# Altium schematic sheet PowerRegulator.SchDoc
size A; SheetNumber: 1; SheetTotal: 1
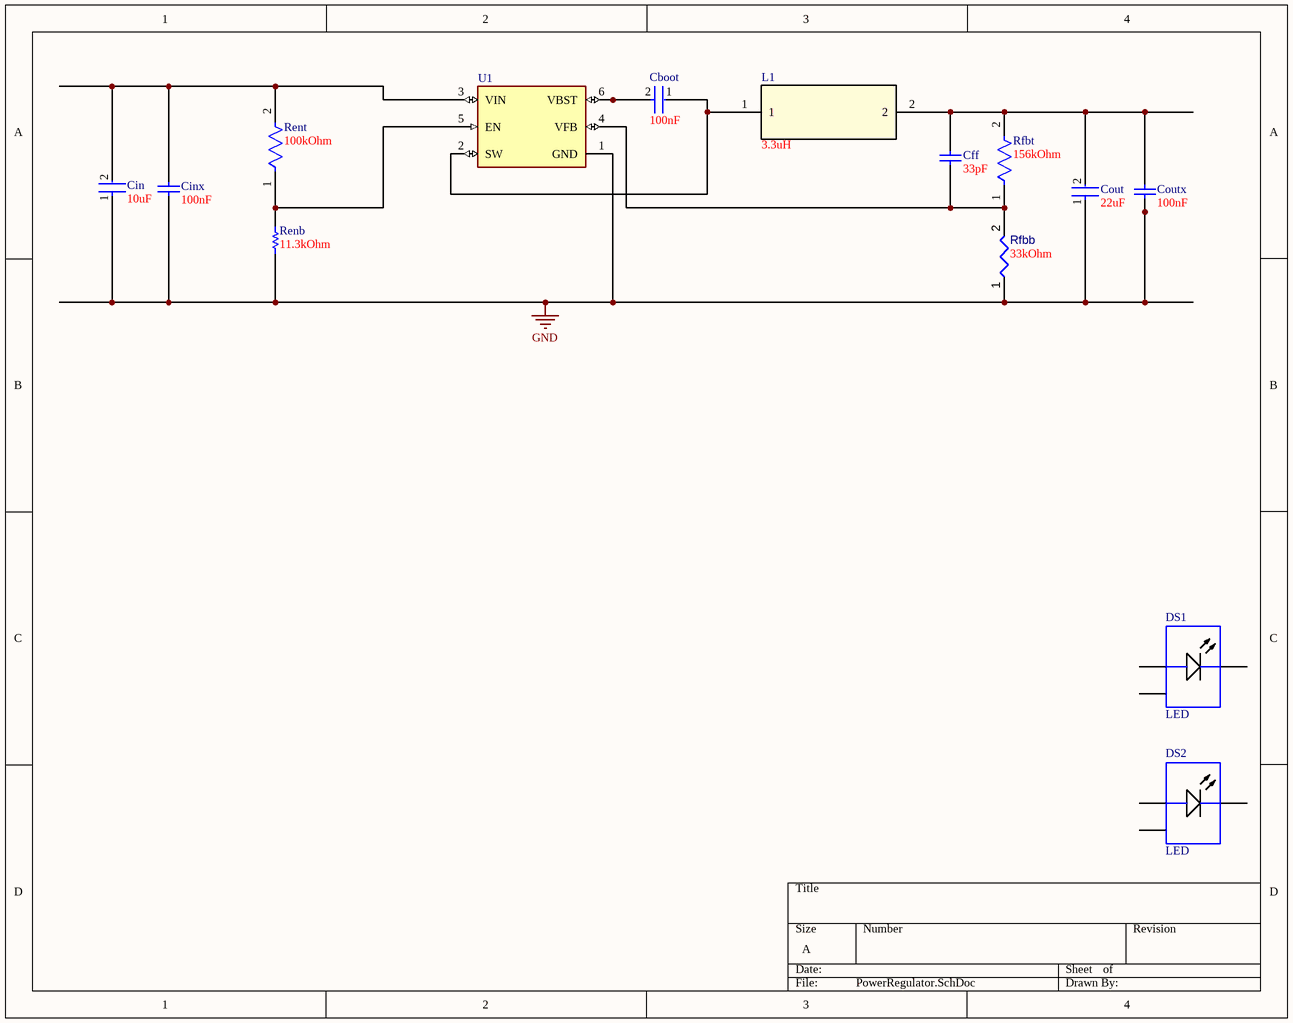
[diagram p0: PowerRegulator.SchDoc]

## Parts
Cboot  100nF  [FP-GRM15-MFG]
Cff  33pF  [CAPC1005X55X25ML05T10]
Cin  10uF  [FP-GRM21B-0_15-IPC_A]
Cinx  100nF  [CAPC1608X90X35ML10T15]
Cout  22uF  [FP-GRM21B-0_2-e0_2_0_7-IPC_C]
Coutx  100nF  [CAPC1608X90X35LL10T15]
DS1  LED  [CREE-MK-R-2_V]
DS2  LED  [CREE-MK-R-2_V]
L1  3.3uH  [NPI54C3R3MTRF_NIC]
Renb  11.3kOhm  [RESC1005X40X25ML05T05]
Rent  100kOhm  [FP-CRCW0402-e3-IPC_C]
Rfbb  value 33kOhm  [RESC1005X40X25ML10T10]  (hidden comment: Resistor 33k +/-5% 0402 63 mW)
Rfbt  156kOhm  [FP-CRCW0402-e3-IPC_C]
U1  TPS562201DDCR  [FP-DDC0006A-IPC_C]  (value not drawn)

## Nets
GND: Cin.1 Cinx.1 Cout.1 Coutx.1 Renb.1 Rfbb.1 U1.1(GND)
NetCboot_1: Cboot.1 L1.1 U1.2(SW)
NetCboot_2: Cboot.2 U1.6(VBST)
NetCff_1: Cff.1 Rfbb.2 Rfbt.1 U1.4(VFB)
NetCff_2: Cff.2 Cout.2 Coutx.2 L1.2 Rfbt.2
NetCin_2: Cin.2 Cinx.2 Rent.2 U1.3(VIN)
NetRenb_2: Renb.2 Rent.1 U1.5(EN)

Not connected (* = marked no-connect by the designer): DS1 1(A) 2(K) 3(EP); DS2 1(A) 2(K) 3(EP)

## Library data of the parts
Cboot = CMP-2100-03641-2: CAP CER 0.1UF 16V X7R 0402; Manufacturer Part Number: GRM155R71C104KA88D; Manufacturer: Murata; Standoff Height: 0mm; Tolerance: 10%; Voltage Rating: 16Vdc; Capacitance: 0.10μF; Value: 0.10μF; RoHS: TRUE; Temperature Characteristic: X7R; Octopart: https://octopart.com/grm155r71c104ka88d-murata-196880; Digikey Description: CAP CER 0.1UF 16V X7R 0402; Device Class L3: Ceramic Capacitors; Height: 0.55mm; ComponentLink2Description: Datasheet; Temperature Range Low: -55°C; Ipc Land Pattern Name: CAPC10050X219; ComponentLink2URL: https://search.murata.co.jp/Ceramy/image/img/A01X/G101/ENG/GRM155R71H471KA01-01A.pdf; Device Class L1: Passive Components; Lead Free: yes; Category: Cap; Package: GRM15; Temperature: -55°C to +125°C; Device Class L2: Capacitors; Material: Ceramic; Temperature Range High: +125°C; Mouser Description: 0402 0.1 uF 16V ±10 % Tolerance X7R SMT Multilayer Ceramic Capacitor
Cff = CMP-2008-04196-1: Manufacturer: Murata; Part Number: GRM1555C1E330JA01D
Cin = CMP-06035-013048-1: Chip Multilayer Ceramic Capacitors for General Purpose, 0805, 10uF, X5R, 15%, 20%, 25V; Max Operating Temperature: 85°C; Package Quantity: 3000; Case/Package: 0805; Depth: 1.25mm; Case Code (Imperial): 0805; Termination: SMD/SMT; Width: 0.049inch; Packaging: Tape and Reel; Tolerance: 20%; Height: 1.25mm; Min Operating Temperature: -55°C; Capacitance: 10uF; Weight: 0.000335oz; Voltage Rating (DC): 25V; Dielectric: X5R; Length: 2mm; Thickness: 0.055inch; Voltage Rating: 25V; Resistor Type: Ceramic; Lead Free: Lead Free; Case Code (Metric): 2012; Mount: Surface Mount; REACH SVHC: No SVHC
Cinx = CMP-2100-03643-1: Chip Capacitor, 0.1 uF, +/- 10%, 50 V, -55 to 125 degC, 0603 (1608 Metric), RoHS, Tape and Reel; Manufacturer: Murata; Dielectric Material: Ceramic; Voltage Rating: 50V; Dielectric: X7R; Insulation Resistance: 10GR; Case Code (Metric): 1608; Lead Free: LeadFree; Depth: 0.8mm; Number of Pins: 2; Radiation Hardening: No; Case/Package: 0603; Manufacturer URL: http://www.murata.com/; Packaging: TapeandReel; Length: 1.6mm; Contact Plating: Tin; Datasheet URL: http://psearch.en.murata.com/capacitor/product/GRM188R71H104KA93%23.pdf; Tolerance: 10%; Case Code (Imperial): 0603; Min Operating Temperature: -55degC; RoHSCompliant: true; Capacitance: 100nF; Voltage: 50V; Termination: SMD/SMT; Mount: SurfaceMount; Material: Ceramic; Package Quantity: 1; Height: 0.8mm; Thickness: 0.035inch; REACH SVHC: NoSVHC; Max Operating Temperature: 125degC; Width: 0.8mm; Package Reference: 0603; Voltage Rating (DC): 50V; Datasheet Version: 42675.0; Package Description: 2-Pin Surface Mount Device, Body 1.6 x 0.8 mm
Cout = CMP-06035-039918-1: Chip Multilayer Ceramic Capacitors for General Purpose, 0805, 22uF, X5R, 15%, 20%, 10V; Dissipation Factor: 0.035%; Min Operating Temperature: -55°C; Voltage Rating (DC): 10V; Height: 1.25mm; Depth: 1.25mm; Max Operating Temperature: 85°C; Width: 1.25mm; Lead Free: Lead Free; Dielectric Material: Ceramic; Weight: 0.000335oz; Tolerance: 20%; Voltage Rating: 10V; Case Code (Metric): 2012; Termination: SMD/SMT; Length: 2mm; Thickness: 0.057inch; Case/Package: 0805; Packaging: Tape and Reel; Voltage: 10V; Case Code (Imperial): 0805; Resistor Type: Ceramic; Package Quantity: 3000; Mount: Surface Mount; Capacitance: 22uF; Dielectric: X5R
Coutx = CMP-2006-02868-1: Part Number: GRM188R71E104KA01D; Manufacturer: Murata
DS1 DS2 = CMP-2100-00977-1: LED, White, 12 V, 2-Pin SMD, RoHS, Tape and Reel
L1 = CMP-006-000001-1: No Description Available; Mfr_Name: NIC Components Corp.; Type: DEV; Copyright: Copyright (C) 2024 Ultra Librarian. All rights reserved.; Design Item ID: NPI54C3R3MTRF; Source: NPI54C3R3MTRF.SchLib; Manufacturer_Part_Number: NPI54C3R3MTRF; RefDes: RefDes
Renb = CMP-2002-08159-1: Part Number: CRCW040211K3FKED; Manufacturer: Vishay Dale
Rent = CMP-2002-08123-3: RES Thick Film, 100kΩ, 1%, 0.063W, 100ppm/°C, 0402; Power Rating: 63mW; Resistance: 100kR; Voltage Rating (DC): 50V; Lead Free: Lead Free; Height: 0.35mm; Contact Plating: Tin; Min Operating Temperature: -55°C; Package Quantity: 10000; Case/Package: 0402; Temperature Coefficient: 100ppm/°C; Number of Terminations: 2; Packaging: Tape and Reel; Max Power Dissipation: 63mW; Case Code (Metric): 1005; Mount: Surface Mount; Width: 0.02inch; Termination: SMD/SMT; Length: 1mm; Number of Pins: 2; Weight: 2.3E-05oz; Radiation Hardening: No; Tolerance: 1%; Military Standard: Not; Features: Automotive AEC-Q200; Depth: 0.5mm; Composition: Thick Film; Max Operating Temperature: 155°C; Voltage Rating: 50V; Case Code (Imperial): 0402
Rfbb = CMP-009-00028-5: Chip Resistor, 33 KOhm, +/- 5%, 0.063 W, -55 to 155 degC, 0402 (1005 Metric); Power: 63mW; Tolerance: 5%; Case/Package: 0402; Mounting Technology: SM; Min Operating Temperature: -55°C; Max Operating Temperature: 155°C; Pins: 2; RoHS Compliant: True
Rfbt = CMP-2002-08218-2: RES Thick Film, 158kΩ, 1%, 0.063W, 100ppm/°C, 0402; Max Power Dissipation: 63mW; Voltage Rating (DC): 50V; Resistance: 158kR; Package Quantity: 10; Termination: SMD/SMT; Composition: Thick Film; Length: 1mm; Lead Free: Lead Free; Number of Terminations: 2; Weight: 2.3E-05oz; Number of Pins: 2; Features: Automotive AEC-Q200; Case Code (Imperial): 0402; Contact Plating: Tin; Min Operating Temperature: -55°C; Width: 0.5mm; Case/Package: 0402; Packaging: Tape and Reel; Max Operating Temperature: 155°C; Radiation Hardening: No; Temperature Coefficient: 100ppm/°C; Power Rating: 63mW; Tolerance: 1%; Military Standard: Not; Height: 0.016inch; Case Code (Metric): 1005; Voltage Rating: 50V; Depth: 0.5mm
U1 = CMP-04918-000361-1: IC REG BUCK ADJ 2A TSOT23-6; Switching Frequency: 580kHz; Max Input Voltage: 17V; Number of Outputs: 1; Output Voltage: 7V; Output Type: Adjustable; Quiescent Current: 400uA; Min Input Voltage: 4.5V; Mount: Surface Mount; Max Operating Temperature: 125°C; Lead Free: Lead Free; Operating Supply Voltage: 17V; Number of Pins: 6; RoHS Compliant: Yes; Contact Plating: Tin; Min Operating Temperature: -40°C; Case/Package: SOT; Max Output Current: 2A